# Altium schematic sheet AWSAM_5.SchDoc
size A3; PageSetup: Record=PageOptions|CenterHorizontal=True|CenterVertical=True|PrintScale=0.73|XCorrection=1.00|YCorrection=1.00|PrintKind=0|BorderSize=5000000|LeftOffset=0|BottomOffset=0|Orientation=2|PaperLength=1000|PaperWidth=1000|Scale=100|PaperSource=7|PrintQuality=-4|MediaType=1|DitherType=10|PaperKind=A4|PrintScaleMode=1
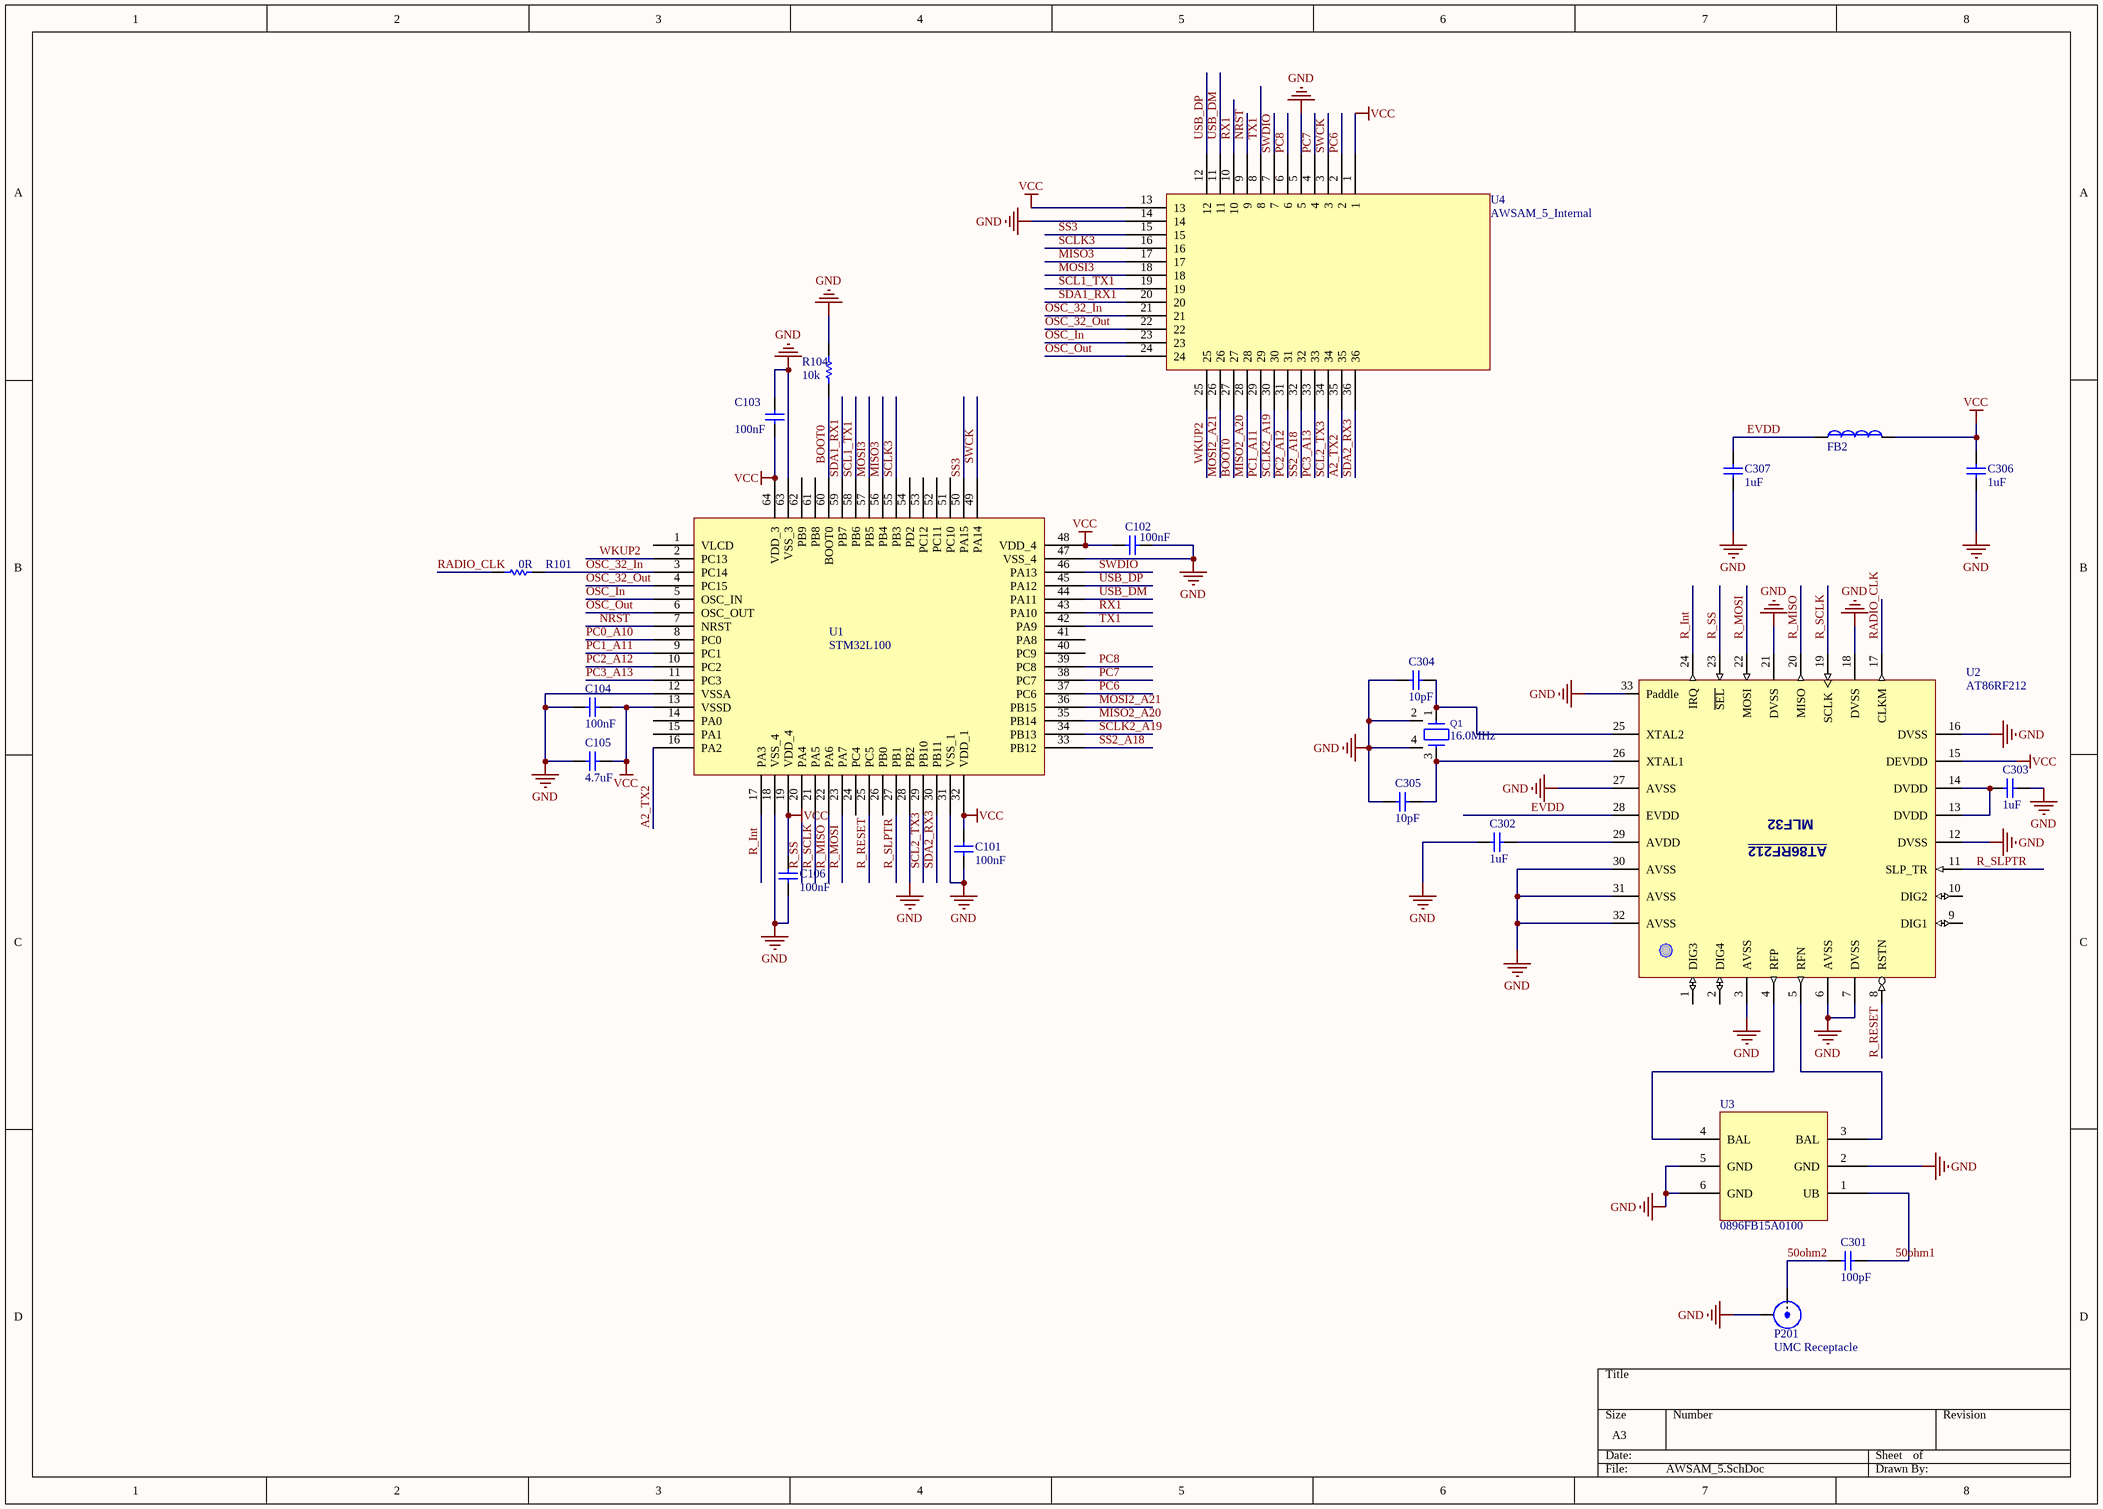
[diagram p0: AWSAM_5.SchDoc]

## Parts
C101  100nF  [CAPC1005L]
C102  100nF  [CAPC1005L]
C103  100nF  [CAPC1005L]
C104  100nF  [CAPC1005L]
C105  4.7uF  [CAPC1005L]
C106  100nF  [CAPC1005L]
C301  100pF  [CAPC1005L]
C302  1uF  [CAPC1005L]
C303  1uF  [CAPC1005L]
C304  10pF  [CAPC1005L]
C305  10pF  [CAPC1005L]
C306  1uF  [CAPC1005L]
C307  1uF  [CAPC1005L]
FB2  BLM15AX102SN1D  [IND0402]  (value not drawn)
P201  UMC Receptacle  [UMC Receptacle]
Q1  value 16.0MHz  [AP7-00061]  (hidden comment: TSX-3225)
R101  0R  [RES0402]
R104  10k  [RES0402]
U1  STM32L100  [TSQFP50P1200X1200-64L]
U2  AT86RF212  [MLF-32]
U3  0896FB15A0100  [AP3-00048]
U4  AWSAM_5_Internal  [AWSAM_5_Internal]

## Nets
GND: C101.2 C102.2 C103.1 C104.1 C105.1 C106.1 C302.2 C303.1 C304.1 C305.2 C306.2 C307.2 P201.Outer Q1.2(GND) Q1.4(GND) R104.1 U1.12(VSSA) U1.18(VSS_4) U1.28(PB2) U1.31(VSS_1) U1.47(VSS_4) U1.63(VSS_3) U2.3(AVSS) U2.6(AVSS) U2.7(DVSS) U2.12(DVSS) U2.16(DVSS) U2.18(DVSS) U2.21(DVSS) U2.27(AVSS) U2.30(AVSS) U2.31(AVSS) U2.32(AVSS) U2.33(Paddle) U3.2(GND) U3.5(GND) U3.6(GND) U4.5 U4.14
VCC: C101.1 C102.1 C103.2 C104.2 C105.2 C106.2 C306.1 FB2.2 U1.13(VSSD) U1.19(VDD_4) U1.32(VDD_1) U1.48(VDD_4) U1.64(VDD_3) U2.15(DEVDD) U4.1 U4.13
50ohm1: C301.1 U3.1(UB)
50ohm2: C301.2 P201.Inner
A2_TX2: U1.16(PA2) U4.35
BOOT0: R104.2 U1.60(BOOT0) U4.27
EVDD: C307.1 FB2.1 U2.28(EVDD)
MISO2_A20: U1.35(PB14) U4.28
MISO3: U1.56(PB4) U4.17
MOSI2_A21: U1.36(PB15) U4.26
MOSI3: U1.57(PB5) U4.18
NRST: U1.7(NRST) U4.9
OSC_32_In: R101.2 U1.3(PC14) U4.21
OSC_32_Out: U1.4(PC15) U4.22
OSC_In: U1.5(OSC_IN) U4.23
OSC_Out: U1.6(OSC_OUT) U4.24
PC0_A10: U1.8(PC0)
PC1_A11: U1.9(PC1) U4.29
PC2_A12: U1.10(PC2) U4.31
PC3_A13: U1.11(PC3) U4.33
PC6: U1.37(PC6) U4.2
PC7: U1.38(PC7) U4.4
PC8: U1.39(PC8) U4.6
R_Int: U1.17(PA3) U2.24(IRQ)
R_MISO: U1.22(PA6) U2.20(MISO)
R_MOSI: U1.23(PA7) U2.22(MOSI)
R_RESET: U1.25(PC5) U2.8(RSTN)
R_SCLK: U1.21(PA5) U2.19(SCLK)
R_SLPTR: U1.27(PB1) U2.11(SLP_TR)
R_SS: U1.20(PA4) U2.23(~{SEL})
RADIO_CLK: R101.1 U2.17(CLKM)
RX1: U1.43(PA10) U4.10
SCL1_TX1: U1.58(PB6) U4.19
SCL2_TX3: U1.29(PB10) U4.34
SCLK2_A19: U1.34(PB13) U4.30
SCLK3: U1.55(PB3) U4.16
SDA1_RX1: U1.59(PB7) U4.20
SDA2_RX3: U1.30(PB11) U4.36
SS2_A18: U1.33(PB12) U4.32
SS3: U1.50(PA15) U4.15
SWCK: U1.49(PA14) U4.3
SWDIO: U1.46(PA13) U4.7
TX1: U1.42(PA9) U4.8
USB_DM: U1.44(PA11) U4.11
USB_DP: U1.45(PA12) U4.12
WKUP2: U1.2(PC13) U4.25
NetC302_1: C302.1 U2.29(AVDD)
NetC303_2: C303.2 U2.13(DVDD) U2.14(DVDD)
NetC304_2: C304.2 Q1.1(IN) U2.25(XTAL2)
NetC305_1: C305.1 Q1.3(OUT) U2.26(XTAL1)
NetU2_4: U2.4(RFP) U3.4(BAL)
NetU2_5: U2.5(RFN) U3.3(BAL)

Not connected (* = marked no-connect by the designer): U1 1(VLCD) 14(PA0) 15(PA1) 24(PC4) 26(PB0) 40(PC9) 41(PA8) 51(PC10) 52(PC11) 53(PC12) 54(PD2) 61(PB8) 62(PB9); U2 1(DIG3) 2(DIG4) 9(DIG1) 10(DIG2)

## Notes on the sheet
- (in symbol AT86RF212) MLF32

## Library data of the parts
C101-C104 C106 = C1608X7R1H222K: GRM155R61A104KA01D; Manufacturer: TDK Corporation; Voltage - Rated: 50V; Tolerance: ±10%; Temperature Coefficient: X7R; Manufacturer Part Number: C1608X7R1H222K; Package / Case: 0603 (1608 Metric); ComponentLink1URL: http://www.tdk.com/pdf/general_B11.pdf; ComponentLink1Description: http://www.tdk.com/pdf/general_B11.pdf; Supplier: Digi-Key; Capacitance: 100nF; SLink: http://www.digikey.com/product-detail/en/GRM155R61A104KA01D/490-1318-6-ND/615373; Digikey: 490-1318-6-ND; Part: GRM155R61A104KA01D
  C101 C102 C104: Supplier Part Number: 445-1309-1-ND
  C103 C106: Supplier Part Number: 490-1318-6-ND
C105 = C1608X7R1H222K: GRM155R60J475ME47D; Manufacturer: TDK Corporation; Voltage - Rated: 50V; Tolerance: ±10%; Temperature Coefficient: X7R; Manufacturer Part Number: C1608X7R1H222K; Package / Case: 0603 (1608 Metric); ComponentLink1URL: http://www.tdk.com/pdf/general_B11.pdf; ComponentLink1Description: http://www.tdk.com/pdf/general_B11.pdf; Supplier: Digi-Key; Supplier Part Number: 445-1309-1-ND; Capacitance: 4.7uF; SLink: http://www.digikey.com/product-detail/en/GRM155R60J475ME47D/490-5915-6-ND/3719863; Digikey: 490-5915-6-ND; Part: GRM155R60J475ME47D
C301 = C1608X7R1H222K: C1005C0G1H101F050BA; Manufacturer: TDK Corporation; Voltage - Rated: 50V; Tolerance: ±10%; Temperature Coefficient: X7R; Manufacturer Part Number: C1608X7R1H222K; Package / Case: 0603 (1608 Metric); ComponentLink1URL: http://www.tdk.com/pdf/general_B11.pdf; ComponentLink1Description: http://www.tdk.com/pdf/general_B11.pdf; Supplier: Digi-Key; Supplier Part Number: 445-1309-1-ND; Capacitance: 100pF; SLink: http://www.digikey.com/product-detail/en/C1005C0G1H101F050BA/445-5362-6-ND/2269900; Digikey: 445-5362-6-ND; Part: C1005C0G1H101F050BA
C302 C303 C306 C307 = C1608X7R1H222K: GRM155R60J105KE19D; Manufacturer: TDK Corporation; Voltage - Rated: 50V; Tolerance: ±10%; Temperature Coefficient: X7R; Manufacturer Part Number: C1608X7R1H222K; Package / Case: 0603 (1608 Metric); ComponentLink1URL: http://www.tdk.com/pdf/general_B11.pdf; ComponentLink1Description: http://www.tdk.com/pdf/general_B11.pdf; Supplier: Digi-Key; Capacitance: 1uF; SLink: http://www.digikey.com/product-detail/en/GRM155R60J105KE19D/490-1320-6-ND/615375; Digikey: 490-1320-6-ND; Part: GRM155R60J105KE19D
  C302 C306 C307: Supplier Part Number: 445-1309-1-ND
  C303: Supplier Part Number: 490-1320-6-ND
C304 C305 = C1608X7R1H222K: 500R07S100GV4T; Manufacturer: TDK Corporation; Voltage - Rated: 50V; Tolerance: ±10%; Temperature Coefficient: X7R; Manufacturer Part Number: C1608X7R1H222K; Package / Case: 0603 (1608 Metric); ComponentLink1URL: http://www.tdk.com/pdf/general_B11.pdf; ComponentLink1Description: http://www.tdk.com/pdf/general_B11.pdf; Supplier: Digi-Key; Supplier Part Number: 445-1309-1-ND; Capacitance: 10pF; SLink: http://www.digikey.com/product-detail/en/500R07S100GV4T/712-1252-6-ND/1786924; Digikey: 712-1252-6-ND; Part: 500R07S100GV4T
FB2 = BLM15AX102SN1D: Manufacturer: Murata Electronics North America; Impedance @ Frequency: 1 kOhm @ 100MHz; Current Rating: 350mA; DC Resistance (DCR): 490 mOhm Max; Manufacturer Part Number: BLM15AX102SN1D; Package / Case: 0402 (1005 Metric); ComponentLink1URL: http://search.murata.co.jp/Ceramy/image/img/PDF/ENG/L0110S0100BLM15AX_SN.pdf; ComponentLink1Description: http://search.murata.co.jp/Ceramy/image/img/PDF/ENG/L0110S0100BLM15AX_SN.pdf; Supplier: Digi-Key; Supplier Part Number: 490-5442-1-ND; SLink: http://www.digikey.com/product-detail/en/BLM15AX102SN1D/490-5442-6-ND/2256894; Digikey: 490-5442-6-ND; Part: BLM15AX102SN1D
P201 = UMC Receptacle: 128-0711-201; Manufacturer: Emerson Network Power Connectivity Johnson; Frequency - Max: 6GHz; Impedance: 50 Ohm; Connector Type: Receptacle, Male Pins; Connector Style: Ultra Miniature Coaxial; Manufacturer Part Number: 128-0711-201; Supplier: Digi-Key; Digikey: J983DKR-ND; ComponentLink1URL: http://media.digikey.com/pdf/Data%20Sheets/Emerson%20PDFs/UMC%20Product%20Catalog.pdf; ComponentLink1Description: http://media.digikey.com/pdf/Data%20Sheets/Emerson%20PDFs/UMC%20Product%20Catalog.pdf; SLink: http://www.digikey.com/product-detail/en/128-0711-201/J983DKR-ND/1662398; Part: 128-0711-201
Q1 = A07-0078: X1E0000210013 TSX-3225 16 MHZ 9.0PF; PartGroup: Frequency devices,Crystals,SMD; Manufacturer: Epson Toyocom; MPN: TSX-3225 16.0000MF09Z-AC3; Tolerance: 15ppm; TemperatureRange: -20 deg C to 70 deg C; ComponentStatus: 'Active (verified)'; Dig: SER3628CT-ND; AN: A07-0078; Height: 0.699999988079071; FootprintStatus: 'New (Not verified)'; Element14: 1712841; SLink: http://nz.element14.com/epson/x1e0000210013/crystal-tsx-3225-16-mhz-9-pf/dp/1712841; Part: X1E0000210013 TSX-3225 16 MHZ 9.0PF
R101 = CRCW040210K0FKED: RES 10.0K OHM 1/16W 1% 0402 SMD; Manufacturer: Vishay Dale; Power (Watts): 0.063W, 1/16W; Temperature Coefficient: ±100ppm/°C; Manufacturer Part Number: CRCW040210K0FKED; Tolerance: ±1%; Package / Case: 0402 (1005 Metric); Height: 0.016" (0.40mm); ComponentLink1URL: http://www.vishay.com/doc?20035; ComponentLink1Description: http://www.vishay.com/doc?20035; Supplier: Digi-Key; Supplier Part Number: 541-10.0KLCT-ND; Resistance (Ohms): 0R; SLink: http://www.digikey.com/product-detail/en/ERJ-2GE0R00X/P0.0JCT-ND/146726; Digikey: P0.0JCT-ND
R104 = CRCW040210K0FKED: MCR01MRTF1002; Manufacturer: Vishay Dale; Power (Watts): 0.063W, 1/16W; Temperature Coefficient: ±100ppm/°C; Tolerance: ±1%; Manufacturer Part Number: CRCW040210K0FKED; Package / Case: 0402 (1005 Metric); Height: 0.016" (0.40mm); ComponentLink1URL: http://www.vishay.com/doc?20035; ComponentLink1Description: http://www.vishay.com/doc?20035; Supplier: Digi-Key; Supplier Part Number: 541-10.0KLCT-ND; Resistance (Ohms): 10k; SLink: http://www.digikey.com/product-detail/en/MCR01MRTF1002/RHM10.0KCDDKR-ND/2796598; Digikey: RHM10.0KCDDKR-ND; Part: MCR01MRTF1002
U1 = STM32L100: STM32L100RCT6; Element14: 2333384; SLink: http://nz.element14.com/stmicroelectronics/stm32l100rct6/mcu-32bit-cortex-m3-32mhz-lqfp/dp/2333384?ost=2333384; Part: STM32L100RCT6
U2 = AT86RF212: AT86RF212B-ZUR; Digikey: AT86RF212B-ZURDKR-ND; SLink: http://www.digikey.co.nz/product-detail/en/AT86RF212B-ZUR/AT86RF212B-ZURDKR-ND/4805999; Part: AT86RF212B-ZUR
U3 = 0896FB15A0100: 0896FB15A0100E; Digikey: 712-1473-6-ND; SLink: http://www.digikey.co.nz/product-detail/en/0896FB15A0100E/712-1473-6-ND/2038630; Part: 0896FB15A0100E